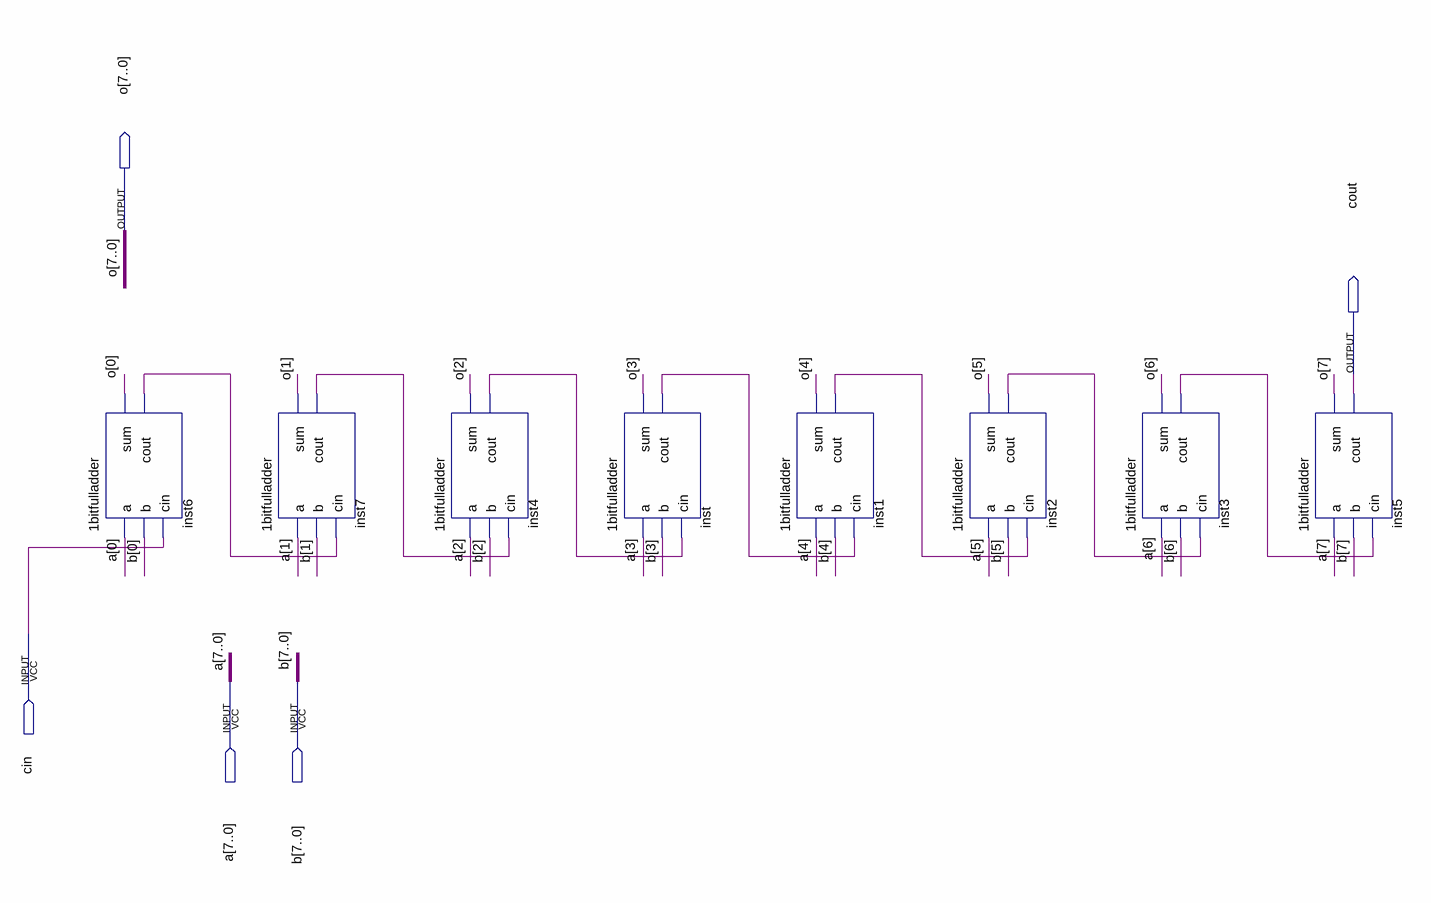
[diagram p0: schematic sheet]
// Quartus schematic 8bitadder.bdf as structural Verilog: 8 symbols, 5 pins
module \8bitadder  (
  input  cin,
  input  [7:0] a,
  input  [7:0] b,
  output [7:0] o,
  output cout
);

  wire inst1_cout, inst2_cout, inst3_cout, inst4_cout, inst6_cout, inst7_cout, inst_cout;

  \1bitfulladder  inst6 (.a(a[0]), .b(b[0]), .cin(cin), .sum(o[0]), .cout(inst6_cout));
  \1bitfulladder  inst7 (.a(a[1]), .b(b[1]), .cin(inst6_cout), .sum(o[1]), .cout(inst7_cout));
  \1bitfulladder  inst4 (.a(a[2]), .b(b[2]), .cin(inst7_cout), .sum(o[2]), .cout(inst4_cout));
  \1bitfulladder  inst (.a(a[3]), .b(b[3]), .cin(inst4_cout), .sum(o[3]), .cout(inst_cout));
  \1bitfulladder  inst1 (.a(a[4]), .b(b[4]), .cin(inst_cout), .sum(o[4]), .cout(inst1_cout));
  \1bitfulladder  inst2 (.a(a[5]), .b(b[5]), .cin(inst1_cout), .sum(o[5]), .cout(inst2_cout));
  \1bitfulladder  inst3 (.a(a[6]), .b(b[6]), .cin(inst2_cout), .sum(o[6]), .cout(inst3_cout));
  \1bitfulladder  inst5 (.a(a[7]), .b(b[7]), .cin(inst3_cout), .sum(o[7]), .cout(cout));
endmodule
